# Altium schematic sheet MOSFET Board Schematics 2.SchDoc
size A4
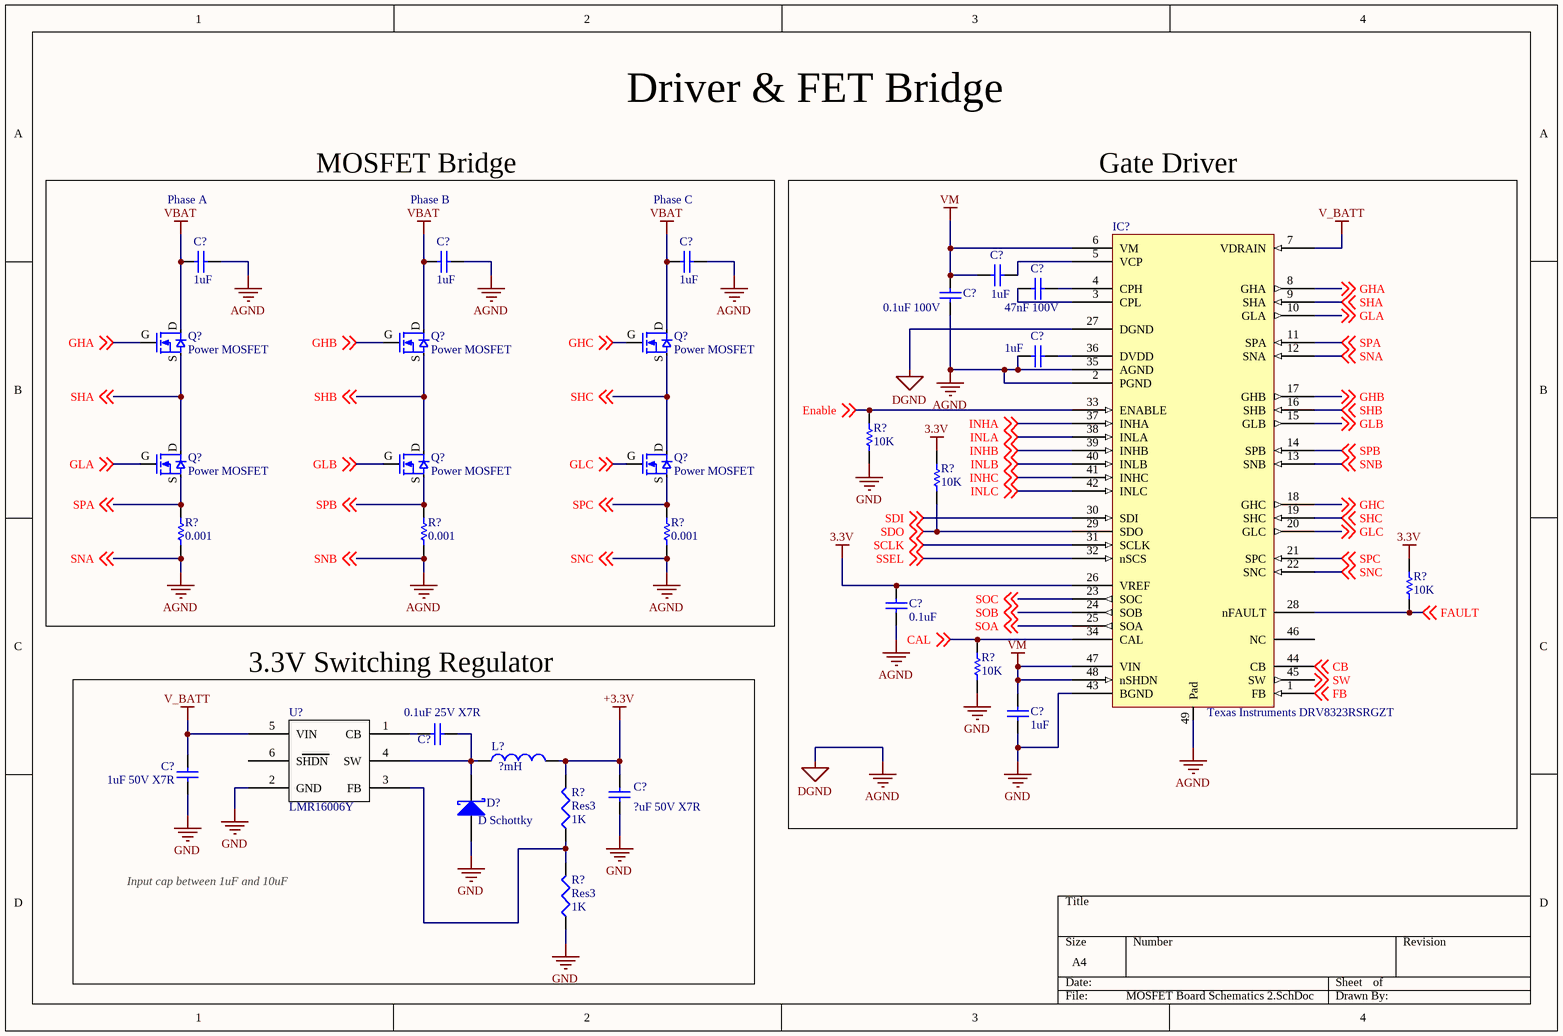
[diagram p0: MOSFET Board Schematics 2.SchDoc]

## Parts
(Parts that share a designator on the sheet are numbered #1, #2 ... from top to bottom, then left to right.)
C?#1  1uF  [PCB-l7zfh8smuc4quhgf702o-1]
C?#2  1uF  [PCB-l7zfh8smuc4quhgf702o-1]
C?#3  1uF  [PCB-l7zfh8smuc4quhgf702o-1]
C?#4  1uF  [CAPC2013X140X45NL15T25]
C?#5  47nF 100V  [CAPC2013X110X50ML20T25]
C?#6  0.1uF 100V  [PCB-4xxxh2d69ab08olz5k3h-1]
C?#7  1uF  [CAPC2013X140X45NL15T25]
C?#8  0.1uF  [CAPC2013X140X45NL15T25]
C?#9  1uF  [PCB-31gyd8pvnu3z1ruid3ov-1]
C?#10  value 0.1uF 25V X7R  [RAD-0.3]  (hidden comment: Cap)
C?#11  value 1uF 50V X7R  [RAD-0.3]  (hidden comment: Cap)
C?#12  value ?uF 50V X7R  [RAD-0.3]  (hidden comment: Cap)
D?  D Schottky  [SMB]
IC?  Texas Instruments DRV8323RSRGZT  [VQFN-48_M]
L?  value ?mH  [0402-A]  (hidden comment: Inductor)
Q?#1  Power MOSFET
Q?#2  Power MOSFET
Q?#3  Power MOSFET
Q?#4  Power MOSFET
Q?#5  Power MOSFET
Q?#6  Power MOSFET
R?#1  10K  [RESC2013X60X30LL20T20]
R?#2  10K  [RESC2013X60X30LL20T20]
R?#3  0.001  [RESC6432X08M]
R?#4  0.001  [RESC6432X08M]
R?#5  0.001  [RESC6432X08M]
R?#6  10K  [RESC2013X60X30LL20T20]
R?#7  10K  [RESC2013X60X30LL20T20]
R?#8  Res3  value 1K  [J1-0603]
R?#9  Res3  value 1K  [J1-0603]
U?  LMR16006Y

## Blocks framed on the sheet
MOSFET Bridge: C?#1-C?#3 Q?#1-Q?#6 R?#3-R?#5
Gate Driver: C?#4-C?#9 IC? R?#1 R?#2 R?#6 R?#7
3.3V Switching Regulator: C?#10-C?#12 D? L? R?#8 R?#9 U?

## Nets
3.3V: C?#8.2 IC?.26(VREF) R?#2.2 R?#6.2
+3.3V: C?#12.2 L?.2 R?#8.2
AGND: C?#1.2 C?#2.2 C?#3.2 C?#6.1 C?#7.1 C?#8.1 IC?.2(PGND) IC?.12(SNA) IC?.13(SNB) IC?.22(SNC) IC?.27(DGND) IC?.35(AGND) IC?.49(Pad) R?#3.1 R?#4.1 R?#5.1 ; off-sheet SNC, off-sheet SNB, off-sheet SNA  [also labelled DGND, SNA, SNB, SNC]
GND: C?#9.1 C?#11.1 C?#12.1 D?.1(A) IC?.43(BGND) R?#1.1 R?#7.1 R?#9.1 U?.2(GND)
V_BATT: C?#11.2 IC?.7(VDRAIN) U?.5(VIN)
VBAT: C?#1.1 C?#2.1 C?#3.1 Q?#1.D Q?#2.D Q?#3.D
VM: C?#4.1 C?#6.2 C?#9.2 IC?.6(VM) IC?.47(VIN) IC?.48(nSHDN)
CAL: IC?.34(CAL) R?#7.2 ; off-sheet CAL
CB: IC?.44(CB) ; off-sheet CB
Enable: IC?.33(ENABLE) R?#1.2 ; off-sheet Enable
FAULT: IC?.28(nFAULT) R?#6.1 ; off-sheet FAULT
FB: IC?.1(FB) ; off-sheet FB
GHA: IC?.8(GHA) Q?#1.G ; off-sheet GHA
GHB: IC?.17(GHB) Q?#2.G ; off-sheet GHB
GHC: IC?.18(GHC) Q?#3.G ; off-sheet GHC
GLA: IC?.10(GLA) Q?#4.G ; off-sheet GLA
GLB: IC?.15(GLB) Q?#5.G ; off-sheet GLB
GLC: IC?.20(GLC) Q?#6.G ; off-sheet GLC
INHA: IC?.37(INHA) ; off-sheet INHA
INHB: IC?.39(INHB) ; off-sheet INHB
INHC: IC?.41(INHC) ; off-sheet INHC
INLA: IC?.38(INLA) ; off-sheet INLA
INLB: IC?.40(INLB) ; off-sheet INLB
INLC: IC?.42(INLC) ; off-sheet INLC
SCLK: IC?.31(SCLK) ; off-sheet SCLK
SDI: IC?.30(SDI) ; off-sheet SDI
SDO: IC?.29(SDO) R?#2.1 ; off-sheet SDO
SHA: IC?.9(SHA) Q?#1.S Q?#4.D ; off-sheet SHA
SHB: IC?.16(SHB) Q?#2.S Q?#5.D ; off-sheet SHB
SHC: IC?.19(SHC) Q?#3.S Q?#6.D ; off-sheet SHC
SOA: IC?.25(SOA) ; off-sheet SOA
SOB: IC?.24(SOB) ; off-sheet SOB
SOC: IC?.23(SOC) ; off-sheet SOC
SPA: IC?.11(SPA) Q?#4.S R?#3.2 ; off-sheet SPA
SPB: IC?.14(SPB) Q?#5.S R?#4.2 ; off-sheet SPB
SPC: IC?.21(SPC) Q?#6.S R?#5.2 ; off-sheet SPC
SSEL: IC?.32(nSCS) ; off-sheet SSEL
SW: IC?.45(SW) ; off-sheet SW
NetC?#4_2: C?#4.2 IC?.5(VCP)
NetC?#5_1: C?#5.1 IC?.3(CPL)
NetC?#5_2: C?#5.2 IC?.4(CPH)
NetC?#7_2: C?#7.2 IC?.36(DVDD)
NetC?#10_1: C?#10.1 D?.2(K) L?.1 U?.4(SW)
NetC?#10_2: C?#10.2 U?.1(CB)
NetR?#8_1: R?#8.1 R?#9.2 U?.3(FB)

Not connected (* = marked no-connect by the designer): IC? 46(NC); U? 6(SHDN)

## Notes on the sheet
- Driver & FET Bridge
- Phase A
- Phase B
- Phase C
- Input cap between 1uF and 10uF

## Library data of the parts
C?#1-C?#3 = C2012X7S2A105K125AB: C Series 0805 1 uF 100 V ±10 % Tolerance X7S SMT Multilayer Ceramic Capacitor; Manufacturer Part Number: C2012X7S2A105K125AB
C?#4 C?#7 C?#8 = CMP-d139185819f50efe-1: Capacitor: ceramic; MLCC; 1uF; 35V; X7R; ±10%; SMD; 0805; Manufacturer Part Number: GMK212B7105KG-T; Lead-Free Status: Lead Free; Voltage Rating (DC): 35.0 V; Capacitance: 1e-06 F; Capacitance Tolerance: ±10%; Case/Package: 0805, 2012; Lifecycle Status: Active; Mounting Style: Surface Mount; RoHS: Compliant; Packaging: Cut Tape (CT); Halogen Free Status: Halogen Free; Dielectric Characteristic: X7R; Octopart URL: http://octopart.com/gmk212b7105kg-t-taiyo+yuden-7073194; Number of Pins: 2; OctopartID: d139185819f50efe
C?#5 = C0805C473K1RACTU: Cap Ceramic 0.047uF 100V X7R 10% SMD 0805 125C Plastic T/R; Capacitance: 4.7e-08 F; Lead-Free Status: R; Voltage Rating (DC): 100.0 V; Capacitance Tolerance: ±10%; Case/Package: 0805; Dielectric Characteristic: X7R; Dielectric Material: Ceramic; Mounting Style: Surface Mount; Octopart Url: https://octopart.com/c0805c473k1ractu-kemet-12557765; OctopartID: f59d3c284d3e2a5a; REACH SVHC Compliance: No SVHC; RoHS: Compliant
C?#6 = HMK212B7104KG-T: Cap Ceramic 0.1uF 100V X7R 10% SMD 0805 125Â°C Embossed T/R; Capacitance: 100 nF; Halogen Free Status: Halogen Free; Capacitance Tolerance: ±10%; Mounting Style: Surface Mount; RoHS: Compliant; Manufacturer Part Number: HMK212B7104KG-T; Voltage Rating (DC): 100 V; Case/Package: 0805, 2012; OctopartID: ddcf14ae146f0208; Packaging: Cut Tape (CT); Lifecycle Status: Active
C?#9 = CMP-18a9d02fce35c76e-1: Eia Case Size: 0805, Voltage: 100, Cap Value: 1000000, Tol: +/-10%, Thickness: 1.25 ± 0.20; Manufacturer Part Number: CGA4J3X7S2A105K125AB; Capacitance: 1.00 µF; Capacitance Tolerance: ±10%; Dielectric Characteristic: X7S; Lead-Free Status: Lead Free; Voltage Rating (DC): 100 V; Octopart URL: https://octopart.com/cga4j3x7s2a105k125ab-tdk-26014714; Case/Package: 2012, 0805; Mounting Style: Surface Mount; Operating Temperature: -55.0 °C (min); Packaging: Tape & Reel (TR), Reel, Cut Tape (CT); REACH SVHC Compliance: No SVHC; RoHS: Compliant; OctopartID: 18a9d02fce35c76e
C?#10-C?#12 = Cap: Capacitor; Published: 8-Jun-2000; LatestRevisionDate: 17-Jul-2002; LatestRevisionNote: Re-released for DXP Platform.; PackageReference: RAD-0.3; Publisher: Altium Limited; PackageDescription: Radial Cap, Thru-Hole; 2 Leads; 0.3 in Pin Spacing
D? = D Schottky: Schottky Diode; Published: 8-Jun-2000; LatestRevisionDate: 17-Jul-2002; LatestRevisionNote: Re-released for DXP Platform.; PackageReference: SMB; Publisher: Altium Limited; PackageDescription: DO-214-AA/SMB; 2 C-Bend Leads; Body 5.3 x 3.6 mm, inc. leads (LxW); Code_JEDEC: DO-214-AA
IC? = DRV8323RSRGZT: 60v Three-Phase Smart Gate Driver With Buck Regulator And Three Current Shunt Amplifiers
L? = Inductor: Code_IEC: 1005; Published: 8-Jun-2000; LatestRevisionDate: 29-May-2009; LatestRevisionNote: IPC-7351 Footprint Added.; PackageReference: 0402-A; Publisher: Altium Limited; PackageDescription: Chip Inductor; Code_JEITA: 0402
Q?#1-Q?#6 = AUIRF8739L2TR
R?#1 R?#2 R?#6 R?#7 = RK73B2ATTD103J: Res Thick Film 0805 10K Ohm 5% 0.125W(1/8W) ±200ppm/C Molded SMD Automotive Punched Paper T/R; Case/Package (SI): 2012; Lead-Free Status: Lead Free; Resistance: 10000.0 Ω; Temperature Coefficient: 200.0 ppm/°C; Voltage Rating (DC): 150.0 V; Case/Package: 0805; Mounting Style: Surface Mount; Octopart Url: https://octopart.com/rk73b2attd103j-koa+speer-2166247; OctopartID: c67a0f51eefb19bd; Power Rating: 0.125 W; Resistance Tolerance: ±5%; RoHS: Compliant; Size-Length: 0.002 m; Size-Width: 0.00125 m
R?#3-R?#5 = CSNL2512FT1L00: CSNL 2512 2 W 0.001O ±1% ±50 ppm/°C Metal Foil Current Sensing Chip Resistor; Lead-Free Status: Lead Free; Mounting Style: Surface Mount; Manufacturer Part Number: CSNL2512FT1L00; Octopart URL: http://octopart.com/csnl2512ft1l00-stackpole+electronics-19206418
R?#8 R?#9 = Res3: Resistor; Published: 8-Jun-2000; LatestRevisionDate: 29-May-2009; LatestRevisionNote: IPC-7351 Footprint Added.; PackageReference: J1-0603; Publisher: Altium Limited; PackageDescription: Chip Resistor
U? = LMR16006YQ3DDCRQ1